# Altium schematic sheet Sheet1.SchDoc
size A4
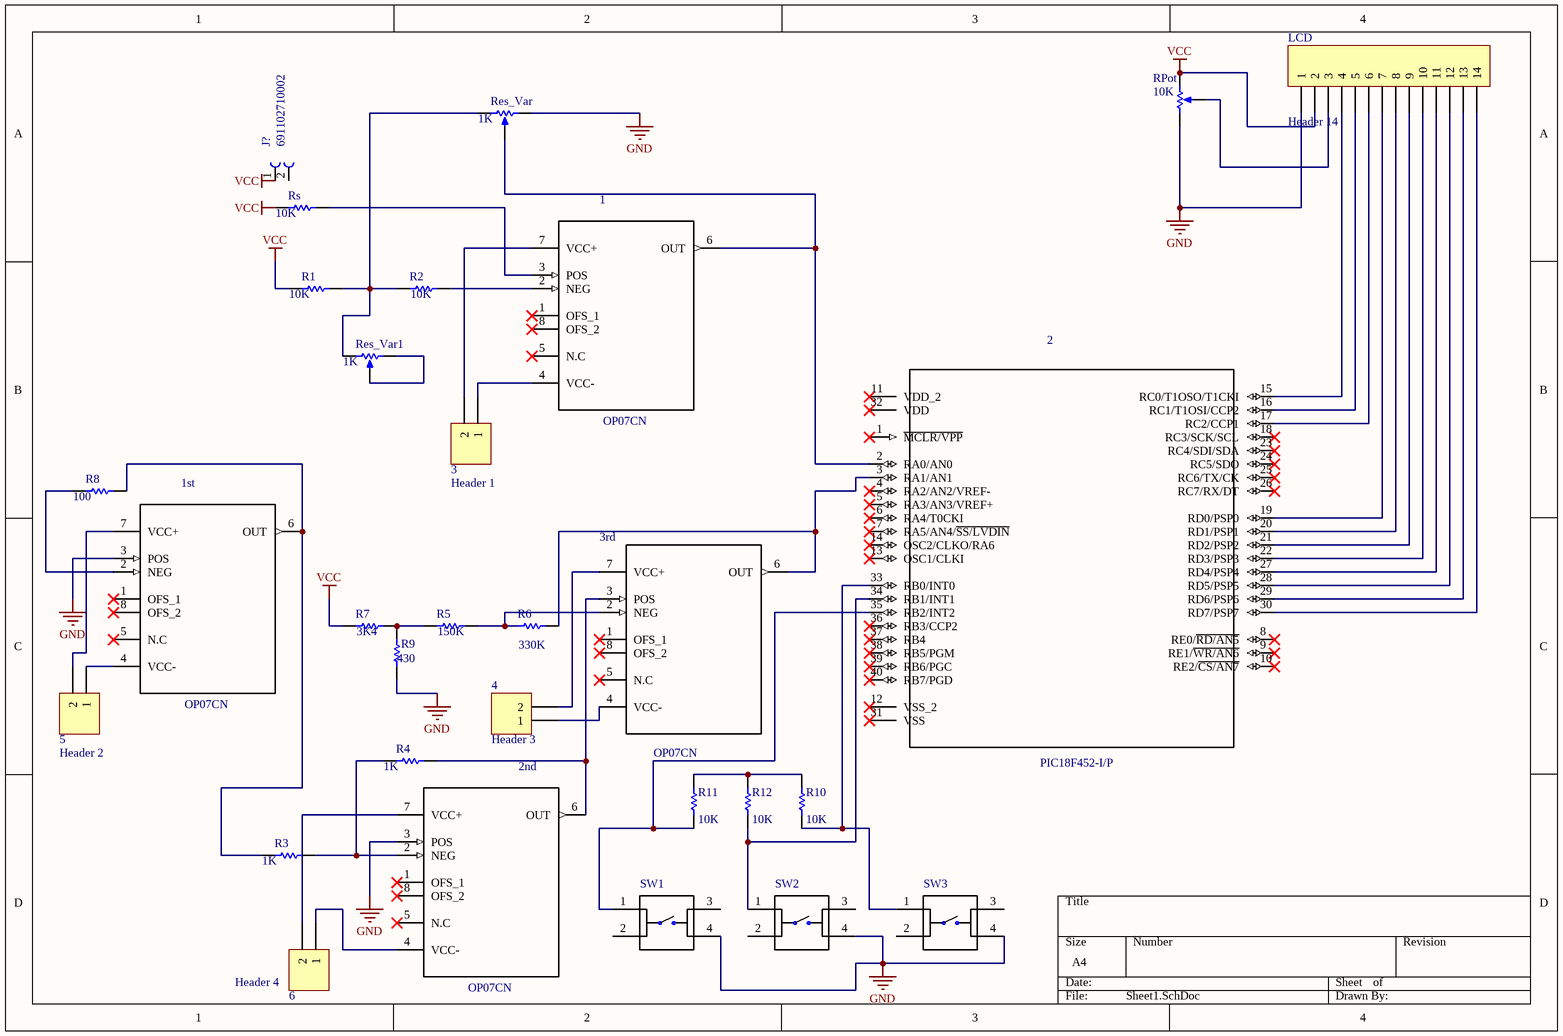
[diagram p0: Sheet1.SchDoc]

## Parts
1  OP07CN  [*DIP254P762X533-8]
1st  OP07CN  [*DIP254P762X533-8]
2  PIC18F452-I/P  [*DIP254P1524X483-40]
2nd  OP07CN  [*DIP254P762X533-8]
3  Header 1  [HDR1X2]
3rd  OP07CN  [*DIP254P762X533-8]
4  Header 3  [HDR1X2]
5  Header 2  [HDR1X2]
6  Header 4  [HDR1X2]
?  RPot  value 10K  [VR5]
J?  691102710002  [*691102710002]
LCD  Header 14  [HDR1X14]
R1  value 10K  [AXIAL-0.3]
R2  value 10K  [AXIAL-0.3]
R3  value 1K  [AXIAL-0.3]
R4  value 1K  [AXIAL-0.3]
R5  value 150K  [AXIAL-0.3]
R6  value 330K  [AXIAL-0.3]
R7  value 3K4  [AXIAL-0.3]
R8  value 100  [AXIAL-0.3]
R9  value 430  [AXIAL-0.3]
R10  value 10K  [AXIAL-0.3]
R11  value 10K  [AXIAL-0.3]
R12  value 10K  [AXIAL-0.3]
Res_Var  value 1K  [VR5]
Res_Var1  value 1K  [VR5]
Rs  value 10K  [AXIAL-0.3]
SW1  1825910-6  [*SW_1825910-6-4]  (value not drawn)
SW2  1825910-6  [*SW_1825910-6-4]  (value not drawn)
SW3  1825910-6  [*SW_1825910-6-4]  (value not drawn)

## Nets
GND: 1st.3(POS) 2nd.3(POS) ?.1(TOP) LCD.1 R9.1 Res_Var.2(BOT) SW1.4 SW2.4 SW3.4
VCC: ?.2(BOT) J?.1 LCD.2 R1.1 R7.1 Rs.1
Net1_2: 1.2(NEG) R2.2
Net1_3: 1.3(POS) Rs.2
Net1_4: 1.4(VCC-) 3.1
Net1_6: 1.6(OUT) 2.2(RA0/AN0) Res_Var.3(TAP)
Net1_7: 1.7(VCC+) 3.2
Net1st_2: 1st.2(NEG) R8.1
Net1st_4: 1st.4(VCC-) 5.1
Net1st_6: 1st.6(OUT) R3.1 R8.2
Net1st_7: 1st.7(VCC+) 5.2
Net2_3: 2.3(RA1/AN1) 3rd.6(OUT) R6.2
Net2_15: 2.15(RC0/T1OSO/T1CKI) LCD.4
Net2_16: 2.16(RC1/T1OSI/CCP2) LCD.5
Net2_17: 2.17(RC2/CCP1) LCD.6
Net2_19: 2.19(RD0/PSP0) LCD.7
Net2_20: 2.20(RD1/PSP1) LCD.8
Net2_21: 2.21(RD2/PSP2) LCD.9
Net2_22: 2.22(RD3/PSP3) LCD.10
Net2_27: 2.27(RD4/PSP4) LCD.11
Net2_28: 2.28(RD5/PSP5) LCD.12
Net2_29: 2.29(RD6/PSP6) LCD.13
Net2_30: 2.30(RD7/PSP7) LCD.14
Net2_33: 2.33(RB0/INT0) R10.1 SW3.1
Net2_34: 2.34(RB1/INT1) R12.1 SW2.1
Net2_35: 2.35(RB2/INT2) R11.1 SW1.1
Net2nd_2: 2nd.2(NEG) R3.2 R4.1
Net2nd_4: 2nd.4(VCC-) 6.1
Net2nd_6: 2nd.6(OUT) 3rd.3(POS) R4.2
Net2nd_7: 2nd.7(VCC+) 6.2
Net3rd_2: 3rd.2(NEG) R5.2 R6.1
Net3rd_4: 3rd.4(VCC-) 4.1
Net3rd_7: 3rd.7(VCC+) 4.2
Net?_3: ?.3(TAP) LCD.3
NetR1_2: R1.2 R2.1 Res_Var.1(TOP) Res_Var1.1(TOP)
NetR5_1: R5.1 R7.2 R9.2
NetR10_2: R10.2 R11.2 R12.2
NetRes_Var1_2: Res_Var1.2(BOT) Res_Var1.3(TAP)

Not connected (* = marked no-connect by the designer): 1 1(OFS_1)* 5(N.C)* 8(OFS_2)*; 1st 1(OFS_1)* 5(N.C)* 8(OFS_2)*; 2 1(~{MCLR/VPP})* 4(RA2/AN2/VREF-)* 5(RA3/AN3/VREF+)* 6(RA4/T0CKI)* 7(RA5/AN4/~{SS/LVDIN})* 8(RE0/~{RD/AN5})* 9(RE1/~{WR/AN6})* 10(RE2/~{CS/AN7})* 11(VDD_2)* 12(VSS_2)* 13(OSC1/CLKI)* 14(OSC2/CLKO/RA6)* 18(RC3/SCK/SCL)* 23(RC4/SDI/SDA)* 24(RC5/SDO)* 25(RC6/TX/CK)* 26(RC7/RX/DT)* 31(VSS)* 32(VDD)* 36(RB3/CCP2)* 37(RB4)* 38(RB5/PGM)* 39(RB6/PGC)* 40(RB7/PGD)*; 2nd 1(OFS_1)* 5(N.C)* 8(OFS_2)*; 3rd 1(OFS_1)* 5(N.C)* 8(OFS_2)*; J? 2; SW1 2 3; SW2 2 3; SW3 2 3

## Library data of the parts
1 1st 2nd 3rd = OP07CN: OP07 Series 22V 5MHz Very Low Offset Single Bipolar Operational Amplifier -DIP-8; MF: STMicroelectronics; Availability: Unavailable; Package: DIP-8 STMicroelectronics; SnapEDA_Link: https://www.snapeda.com/parts/OP07CN/STMicroelectronics/view-part/?ref=snap; MP: OP07CN; Price: None; Value: *
2 = PIC18F452-I/P: PIC18 Series 1.5 kB RAM 32 kB Flash 8-Bit Enhanced Microcontroller - PDIP-40; MF: Microchip; Availability: Unavailable; SnapEDA_Link: https://www.snapeda.com/parts/PIC18F452-I/P/Microchip/view-part/?ref=snap; MP: PIC18F452-I/P; Package: DIP-40 Microchip; Price: None; Value: *
3-6 = Header 2: Header, 2-Pin; LatestRevisionDate: 17-Jul-2002; LatestRevisionNote: Re-released for DXP Platform.; Publisher: Altium Limited
? Res_Var Res_Var1 = RPot: Potentiometer; Sim Note: Enter the Resistance value and the set point into parameter fields.; Set Position: 0.5; Published: 8-Jun-2000; LatestRevisionDate: 17-Jul-2002; LatestRevisionNote: Re-released for DXP Platform.; PackageReference: VR5; Publisher: Altium Limited; PackageDescription: Variable Resistor, Thru-Hole; 3 Leads
J? = 691102710002: 102 Series 5mm Pitch Straight, PCB Terminal Block, Through Hole, 2 Way; MF: Wurth Electronics; Package: None; SnapEDA_Link: https://www.snapeda.com/parts/691102710002/Wurth%20Electronics%20Inc./view-part/?ref=snap; MP: 691102710002; Price: None; Availability: Unavailable; Value: *
LCD = Header 14: Header, 14-Pin; LatestRevisionDate: 17-Jul-2002; LatestRevisionNote: Re-released for DXP Platform.; Publisher: Altium Limited
R1-R12 Rs = Res1: Resistor; Published: 8-Jun-2000; LatestRevisionDate: 17-Jul-2002; LatestRevisionNote: Re-released for DXP Platform.; PackageReference: AXIAL-0.3; Publisher: Altium Limited; PackageDescription: Axial Device, Thru-Hole; 2 Leads; 0.3 in Pin Spacing
SW1-SW3 = 1825910-6: FSM4JH=6MM TACT SWITCH, HIGH TEMP; Contact_Current_Rating: 50 mA; MF: TE Connectivity; Configuration_Pole-Throw: Single Pole - Single Throw; Package: None; MP: 1825910-6; EU_RoHS_Compliance: Compliant; TE_purchase_URL: https://www.te.com/usa-en/product-1825910-6.html?te_bu=Cor&te_type=disp&te_campaign=seda_glo_cor-seda-global-disp-prtnr-fy19-seda-model-bom-cta_sma-317_1&elqCampaignId=32493; Price: None; Availability: Unavailable; SnapEDA_Link: https://www.snapeda.com/parts/1825910-6/TE%20Connectivity%20ALCOSWITCH%20Switches/view-part/?ref=snap; Value: *